# EAGLE design AE_ESP_board (EAGLE 7.5.0)
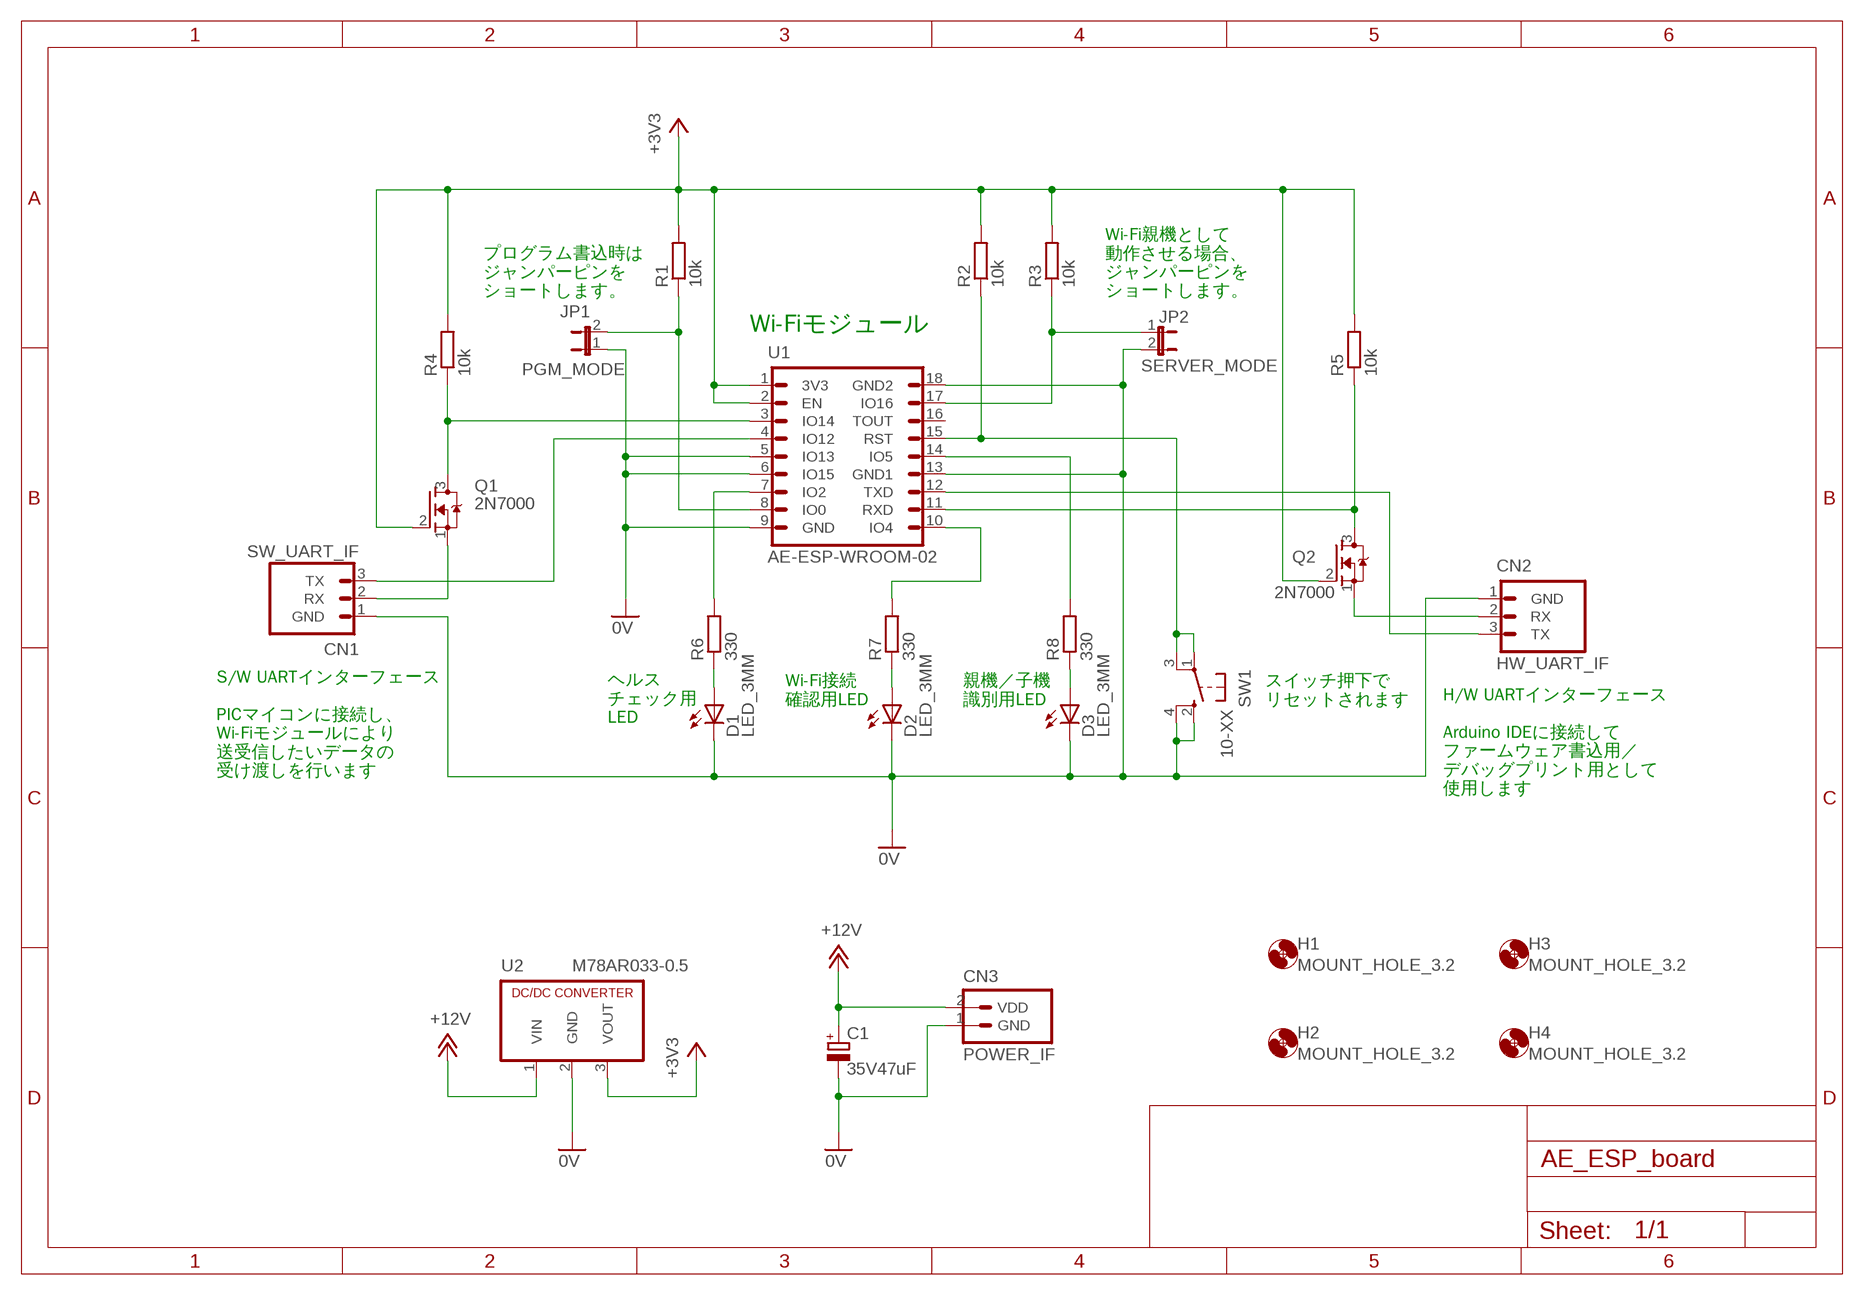
[diagram p0: schematic, sheet 1]

## Parts
C1  35V47uF  ELECAP_D5_100MIL  [ELECAP_D5_100MIL]
CN1  SW_UART_IF  UART_IF  [UART_IF_3PIN]
CN2  HW_UART_IF  UART_IF  [UART_IF_3PIN]
CN3  POWER_IF  [HEADER_2PIN_POWER_IF]
D1  LED_3MM  [LED3MM]
D2  LED_3MM  [LED3MM]
D3  LED_3MM  [LED3MM]
H1  MOUNT_HOLE_3.2  [3,2]
H2  MOUNT_HOLE_3.2  [3,2]
H3  MOUNT_HOLE_3.2  [3,2]
H4  MOUNT_HOLE_3.2  [3,2]
JP1  PGM_MODE  JP1E  [JP1]
JP2  SERVER_MODE  JP1E  [JP1]
Q1  2N7000  [TO-92NL]
Q2  2N7000  [TO-92NL]
R1  10k  RESISTOR_200MIL  [RESISTOR_0204_200MIL]
R2  10k  RESISTOR_200MIL  [RESISTOR_0204_200MIL]
R3  10k  RESISTOR_200MIL  [RESISTOR_0204_200MIL]
R4  10k  RESISTOR_200MIL  [RESISTOR_0204_200MIL]
R5  10k  RESISTOR_200MIL  [RESISTOR_0204_200MIL]
R6  330  RESISTOR_200MIL  [RESISTOR_0204_200MIL]
R7  330  RESISTOR_200MIL  [RESISTOR_0204_200MIL]
R8  330  RESISTOR_200MIL  [RESISTOR_0204_200MIL]
SW1  10-XX  [B3F-10XX]
U1  AE-ESP-WROOM-02  [DIL18_AE-ESP-WROOM-02]
U2  M78AR033-0.5  [SIP3]

## Nets
0V: C1.- CN1.1(GND) CN2.1(GND) CN3.1(GND) D1.K(C) D2.K(C) D3.K(C) JP1.1 JP2.2 SW1.2(S) SW1.4(S1) U1.5(IO13) U1.6(IO15) U1.9(GND) U1.13(GND1) U1.18(GND2) U2.2(GND)
+3V3: Q1.2(G) Q2.2(G) R1.2 R2.2 R3.2 R4.2 R5.2 U1.1(3V3) U1.2(EN) U2.3(VOUT)
+12V: C1.+ CN3.2(VDD) U2.1(VIN)
HW_UART_TXD: CN2.3(TX) U1.12(TXD)
LED_CONNECTING: R7.2 U1.10(IO4)
LED_HCHECK: R6.2 U1.7(IO2)
N$1: CN1.3(TX) U1.4(IO12)
N$2: JP2.1 R3.1 U1.17(IO16)
N$3: CN2.2(RX) Q2.1(S)
N$4: R8.2 U1.14(IO5)
N$5: D3.A R8.1
N$7: Q2.3(D) R5.1 U1.11(RXD)
N$9: JP1.2 R1.1 U1.8(IO0)
N$10: R2.1 SW1.1(P) SW1.3(P1) U1.15(RST)
N$11: D2.A R7.1
N$12: D1.A R6.1
SW_UART_RXD: CN1.2(RX) Q1.1(S)
SW_UART_RXD_IN: Q1.3(D) R4.1 U1.3(IO14)
Unconnected: U1.16(TOUT)

## Notes on the sheet
- プログラム書込時は
  ジャンパーピンを
  ショートします。
- Wi-Fi親機として
  動作させる場合、
  ジャンパーピンを
  ショートします。
- Wi-Fiモジュール
- Wi-Fi接続
  確認用LED
- 親機／子機
  識別用LED
- スイッチ押下で
  リセットされます
- ヘルス
  チェック用
  LED
- S/W UARTインターフェース
  
  PICマイコンに接続し、
  Wi-Fiモジュールにより
  送受信したいデータの
  受け渡しを行います
- H/W UARTインターフェース
  
  Arduino IDEに接続して
  ファームウェア書込用／
  デバッグプリント用として
  使用します

## Library data of the parts
C1 = Parts:ELECAP: 電解コンデンサー
CN1 CN2 = PartsForProto:UART_IF: UART インターフェース
CN3 = PartsForProto:POWER_IF: 電源供給インターフェース
D1-D3 = Parts:LED: 発光ダイオード
H1-H4 = Generic:MOUNT_HOLE
JP1 JP2 = Parts:JP1E: JUMPER
Q1 Q2 = Parts:2N7000: Ｎチャネル エンハンスメントタイプ ＭＯＳＦＥＴ ■ VDSS ６０Ｖ ■ VGSS ±２０Ｖ ■ RDS(ON) 標準３．２Ω 最大７．５Ω（＠VGS=5.0V） ■ ID １１５ｍＡ ■ PD ３００ｍＷ ■ Ciss 標準２２ｐＦ 最大５０ｐＦ ■ Coss 標準１１ｐＦ 最大２５ｐＦ ■ Crss 標準２ｐＦ 最大５ｐＦ ■ tD(ON) 標準７ｎｓ 最大２０ｎｓ ■ tD(OFF) 標準１１ｎｓ 最大２０ｎｓ ■ 形状：ＳＯＴ－２３
R1-R8 = Parts:RESISTOR: 抵抗器
SW1 = Parts:10-XX: TACT SWITCH
U1 = PartsForProto:AE-ESP-WROOM-02: Ｗｉ－Ｆｉモジュール ＤＩＰ化キット ＥＳＰ－ＷＲＯＯＭ－０２は ＥＳＰ８２６６ＥＸ（ＳｏＣ、３２ｂｉｔ ＭＣＵ）を搭載した ＷｉＦｉモジュールです。
U2 = Parts:M78A*: 超高効率ＤＣ－ＤＣコンバーター ・広範な入力電圧範囲（１：５）：ＤＣ６．５Ｖ～３２Ｖ ・出力：ＤＣ５Ｖ／０．５Ａ ・スイッチング周波数：３３０ｋＨｚ

## Board
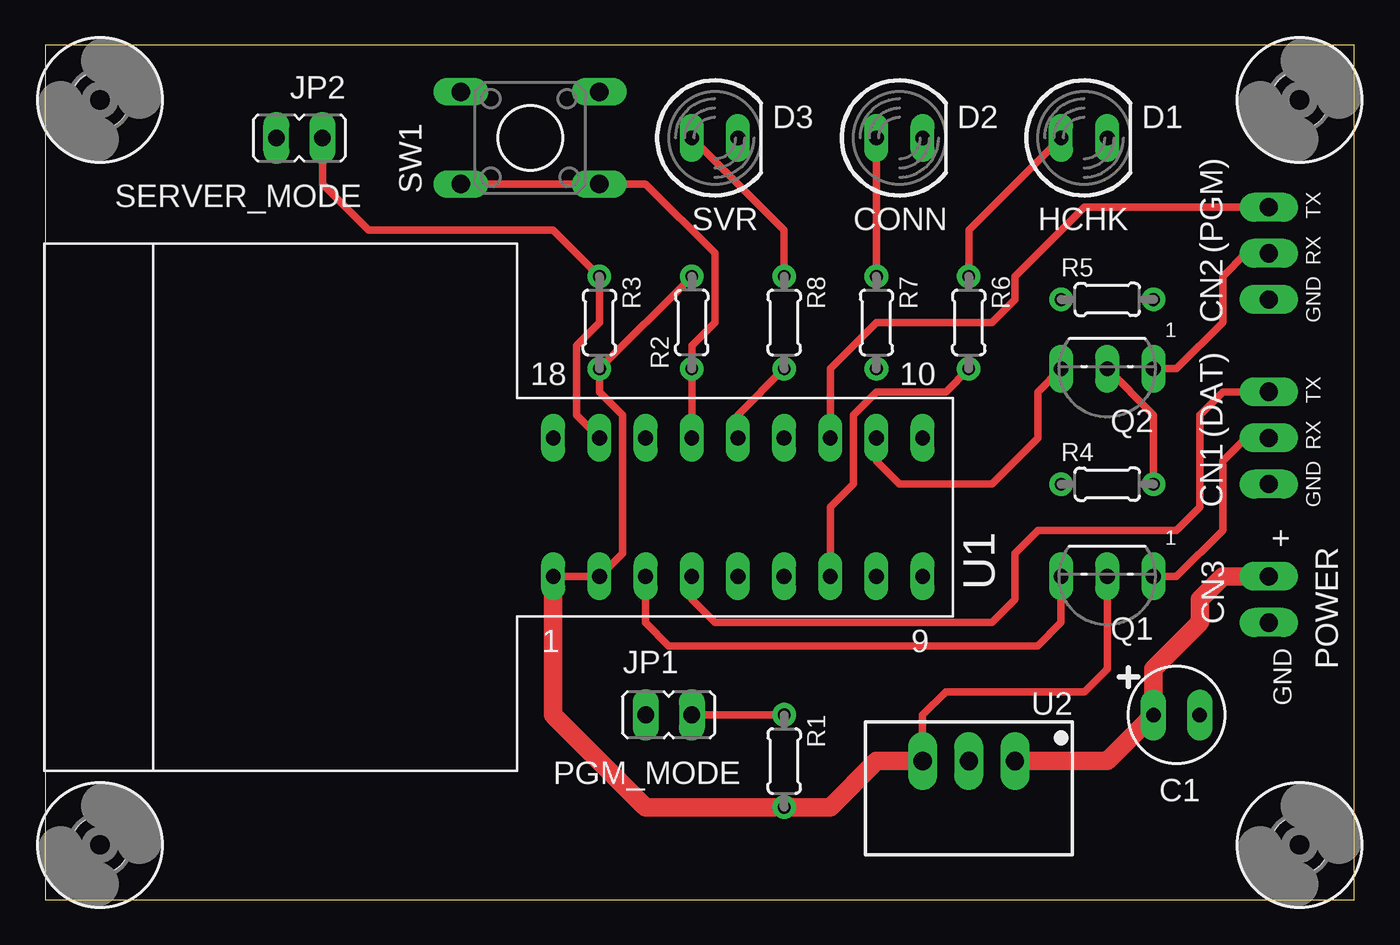
[diagram p1: board, top side]
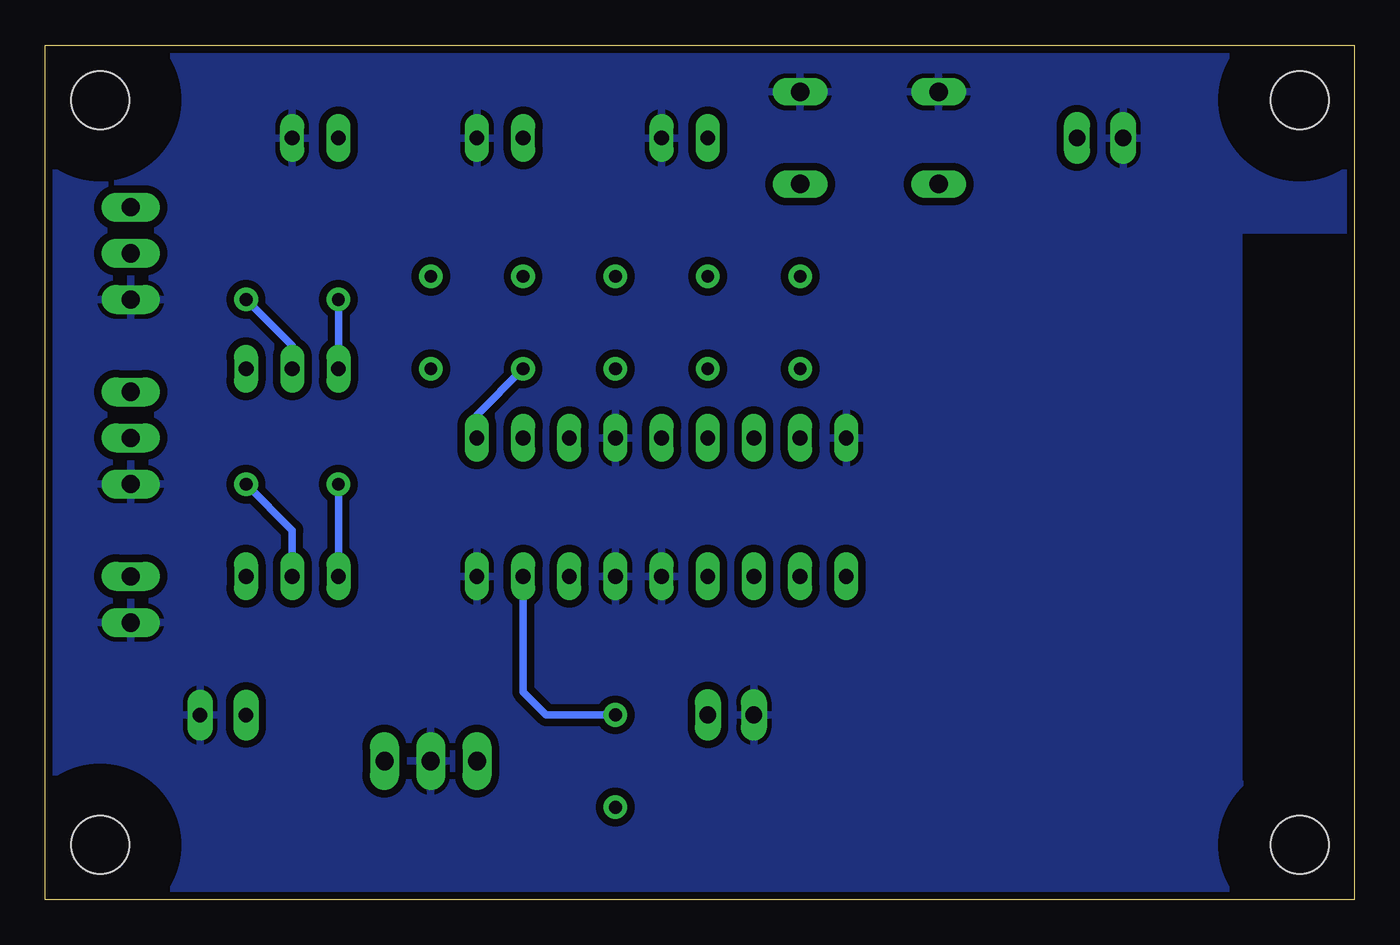
[diagram p2: board, bottom side, seen from below]

Size 72 x 47 mm. Coordinates in mm from the lower left corner, seen from the top.
Outline: 0,0 72,0 72,47 0,47 0,0
Copper layers (1*16): Top 0.035mm / dielectric 1.5mm / Bottom 0.035mm
Design rules "SeeedStudio_2layer_DRU_no_angle_20140221": minimum track width 6mil, minimum drill 12mil, track to track 6mil, track to pad 6mil, pad to pad 6mil, via to via 6mil, smd to smd 0mil, copper to edge 10mil, drill to drill 10mil, minimum pad ring 10mil, minimum via ring 6mil, stop-mask expansion 2mil, vias tented up to drill 100mil, thermal gap 10mil

### Footprints (pad centres in the part's own frame; a part is rotated, then mirrored left to right if it is on the bottom)
ELECAP_D5_100MIL = drill 0.8 pad 1.4 long: + -1.27,0; - 1.27,0
UART_IF_3PIN = drill 1 pad 1.6 long: 1 0,0; 2 2.54,0; 3 5.08,0
HEADER_2PIN_POWER_IF = drill 1 pad 1.6 long: 1 0,0; 2 2.54,0
LED5MM = drill 0.813 long: A -1.27,0; K 1.27,0
3,2 = hole 3.2: 0,0
JP1 = drill 0.914 long: 1 0,0; 2 0,2.54
TO-92NL = drill 0.813 long: 1 0,0; 2 2.54,0; 3 5.08,0
RESISTOR_0204_200MIL = drill 0.7 pad 1.3: 1 -2.54,0; 2 2.54,0
B3F-10XX = drill 1.016 long: 1 0,0; 2 5.08,0; 3 0,-7.62; 4 5.08,-7.62
DIL18_AE-ESP-WROOM-02 = drill 0.813 long: 1 0,0; 2 2.54,0; 3 5.08,0; 4 7.62,0; 5 10.16,0; 6 12.7,0; 7 15.24,0; 8 17.78,0; 9 20.32,0; 10 20.32,7.62; 11 17.78,7.62; 12 15.24,7.62; 13 12.7,7.62; 14 10.16,7.62; 15 7.62,7.62; 16 5.08,7.62; 17 2.54,7.62; 18 0,7.62
SIP3 = drill 1 pad 1.6 long: 1 0,0; 2 2.54,0; 3 5.08,0

### Placement (x,y rotation side)
C1  62.23,10.16 0 top
CN1  67.31,22.86 90 top
CN2  67.31,33.02 90 top
CN3  67.31,15.24 90 top
D1  LED_5MM  [LED5MM]  57.15,41.91 0 top
D2  LED_5MM  [LED5MM]  46.99,41.91 0 top
D3  LED_5MM  [LED5MM]  36.83,41.91 0 top
H1  69,44 0 top
H2  3,44 0 top
H3  3,3 0 top
H4  69,3 0 top
JP1  33.02,10.16 270 top
JP2  15.24,41.91 90 top
Q1  60.96,17.78 180 top
Q2  60.96,29.21 180 top
R1  40.64,7.62 270 top
R2  35.56,31.75 90 top
R3  30.48,31.75 270 top
R4  58.42,22.86 0 top
R5  58.42,33.02 0 top
R6  50.8,31.75 270 top
R7  45.72,31.75 270 top
R8  40.64,31.75 270 top
SW1  22.86,39.37 90 top
U1  27.94,17.78 0 top
U2  53.34,7.62 180 top

### Tracks (layer width: path | path; a pad name or v marks a point on that pad's centre or on a via)
0V
  pour Bottom (isolate 0.406, rank 3): -1.27,48.26 -1.27,36.83 6.35,36.83 6.35,6.35 -1.27,6.35 -1.27,-1.27 73.66,-1.27 73.66,48.26
+3V3
  Top 0.406: U2.3 48.26,10.16 49.53,11.43 57.15,11.43 58.42,12.7 Q1.2 | U1.1 U1.2 31.75,19.05 31.75,26.67 30.48,27.94 R3.2 R2.2 | R4.2 60.96,26.67 Q2.2
  Top 1.016: U2.3 45.72,7.62 43.18,5.08 R1.2 33.02,5.08 27.94,10.16 U1.1
  Bottom 0.406: Q2.2 58.42,30.48 R5.2 | Q1.2 58.42,20.32 R4.2
+12V
  Top 1.016: U2.1 58.42,7.62 C1.+ 60.96,12.7 63.5,15.24 63.5,16.51 64.77,17.78 CN3.2
HW_UART_TXD
  Top 0.406: CN2.3 57.15,38.1 53.34,34.29 53.34,33.02 52.07,31.75 45.72,31.75 43.18,29.21 U1.12
LED_CONNECTING
  Bottom 0.406: R7.2 48.26,26.67 U1.10
LED_HCHECK
  Top 0.406: U1.7 43.18,21.59 44.45,22.86 44.45,26.67 45.72,27.94 49.53,27.94 R6.2
N$1
  Top 0.406: U1.4 35.56,16.51 36.83,15.24 52.07,15.24 53.34,16.51 53.34,19.05 54.61,20.32 62.23,20.32 63.5,21.59 63.5,26.67 64.77,27.94 CN1.3
N$2
  Top 0.406: U1.17 29.21,26.67 29.21,30.48 30.48,31.75 R3.1 27.94,36.83 17.78,36.83 15.24,39.37 JP2.1
N$3
  Top 0.406: Q2.1 62.23,29.21 64.77,31.75 64.77,34.29 66.04,35.56 CN2.2
N$4
  Top 0.406: U1.14 38.1,26.67 R8.2
N$5
  Top 0.406: R8.1 40.64,36.83 D3.A
N$7
  Top 0.406: U1.11 45.72,24.13 46.99,22.86 52.07,22.86 54.61,25.4 54.61,27.94 Q2.3
  Bottom 0.406: R5.1 Q2.3
N$9
  Top 0.406: R1.1 JP1.2
  Bottom 0.406: U1.8 45.72,11.43 44.45,10.16 R1.1
N$10
  Top 0.406: U1.15 R2.1 35.56,30.48 36.83,31.75 36.83,35.56 33.02,39.37 SW1.3 SW1.1
N$11
  Top 0.406: R7.1 D2.A
N$12
  Top 0.406: R6.1 50.8,36.83 D1.A
SW_UART_RXD
  Top 0.406: Q1.1 62.23,17.78 64.77,20.32 64.77,24.13 66.04,25.4 CN1.2
SW_UART_RXD_IN
  Top 0.406: Q1.3 55.88,15.24 54.61,13.97 34.29,13.97 33.02,15.24 U1.3
  Bottom 0.406: Q1.3 R4.1

### Text on the board
tPlace: SERVER_MODE | SVR | CONN | HCHK | (PGM) | (DAT) | POWER | PGM_MODE